# EAGLE design ISPnub_v1.2 (EAGLE 7.2.0)
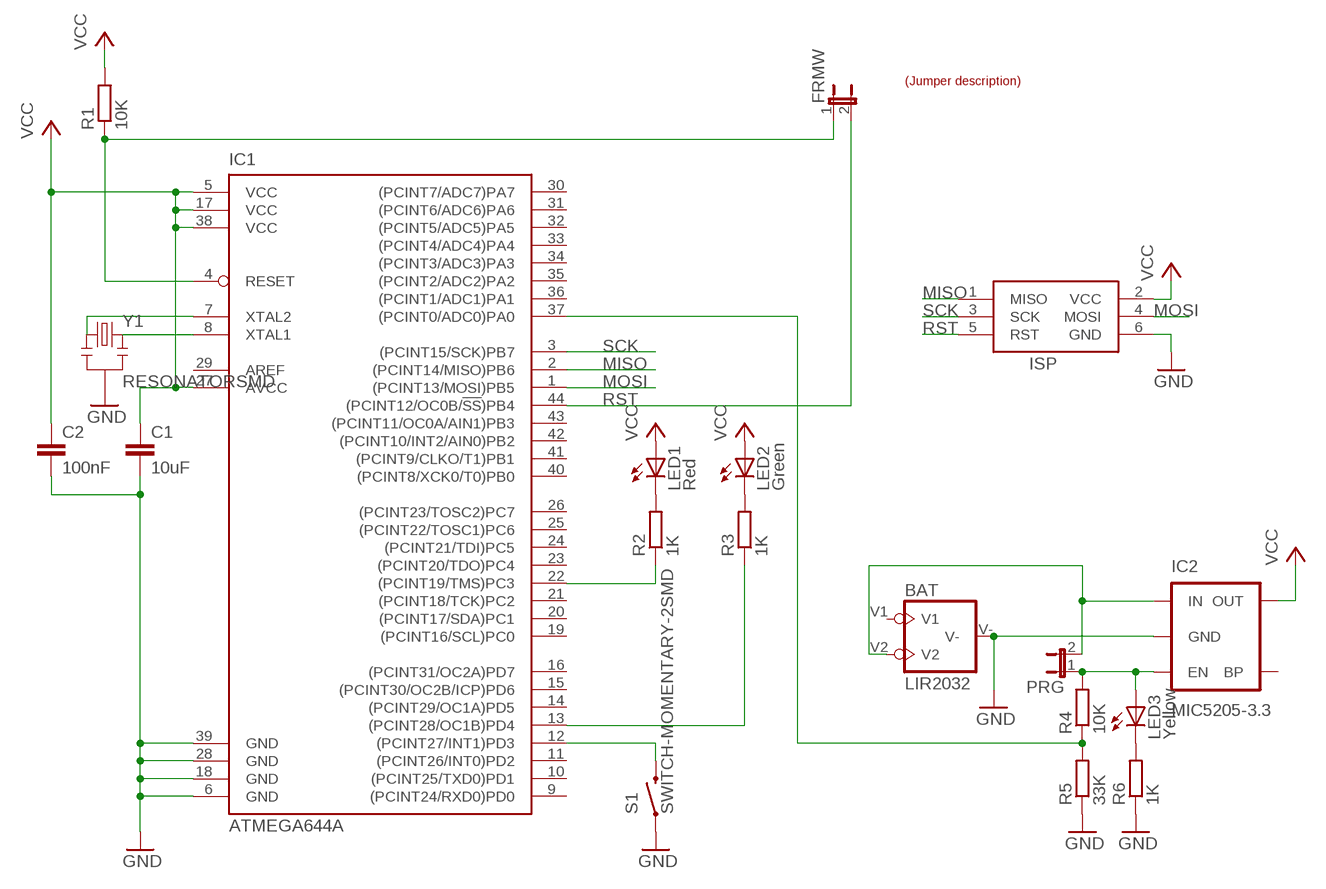
[diagram p0: schematic, sheet 1]

## Parts
BAT  LIR2032  BATTERY_2032  [BATT2032]
C1  10uF  C-EUC0805  [C0805]
C2  100nF  C-EUC0805  [C0805]
FRMW  JP1E  [JP1]
IC1  ATMEGA644A  [TQFP44]
IC2  MIC5205-3.3  V_REG_LDOSMD  [SOT23-5]
ISP  AVRISP-6  [AVRISP]
LED1  Red  LEDCHIP-LED0805  [CHIP-LED0805]
LED2  Green  LEDCHIP-LED0805  [CHIP-LED0805]
LED3  Yellow  LEDCHIP-LED0805  [CHIP-LED0805]
PRG  JP1E  [JP1]
R1  10K  R-EU_R0805  [R0805]
R2  1K  R-EU_R0805  [R0805]
R3  1K  R-EU_R0805  [R0805]
R4  10K  R-EU_R0402  [R0402]
R5  33K  R-EU_R0402  [R0402]
R6  1K  R-EU_R0805  [R0805]
S1  SWITCH-MOMENTARY-2SMD  [TACTILE_SWITCH_SMD]
U$1  LABEL_JUMPER_1X2  [JUMP2_DESC]
Y1  RESONATORSMD  [RESONATOR-SMD]

## Nets
GND: BAT.V- C1.2 C2.2 IC1.6(GND) IC1.18(GND) IC1.28(GND) IC1.39(GND) IC2.2(GND) ISP.6(GND) R5.1 R6.1 S1.1 Y1.2
MISO: IC1.2((PCINT14/MISO)PB6) ISP.1(MISO)
MOSI: IC1.1((PCINT13/MOSI)PB5) ISP.4(MOSI)
N$1: FRMW.1 IC1.4(RESET) R1.1
N$2: IC1.8(XTAL1) Y1.3
N$3: IC1.7(XTAL2) Y1.1
N$4: IC1.12((PCINT27/INT1)PD3) S1.3
N$5: IC1.13((PCINT28/OC1B)PD4) R3.1
N$6: LED2.C R3.2
N$7: IC1.22((PCINT19/TMS)PC3) R2.1
N$8: LED1.C R2.2
N$9: BAT.V2 IC2.1(IN) PRG.2
N$10: IC2.3(EN) LED3.A PRG.1 R4.2
N$11: IC1.37((PCINT0/ADC0)PA0) R4.1 R5.2
N$12: LED3.C R6.2
RST: FRMW.2 IC1.44((PCINT12/OC0B/!SS!)PB4) ISP.5(RST)
SCK: IC1.3((PCINT15/SCK)PB7) ISP.3(SCK)
VCC: C1.1 C2.1 IC1.5(VCC) IC1.17(VCC) IC1.27(AVCC) IC1.38(VCC) IC2.5(OUT) ISP.2(VCC) LED1.A LED2.A R1.2
Unconnected: IC1.9((PCINT24/RXD0)PD0) IC1.10((PCINT25/TXD0)PD1) IC1.11((PCINT26/INT0)PD2) IC1.14((PCINT29/OC1A)PD5) IC1.15((PCINT30/OC2B/ICP)PD6) IC1.16((PCINT31/OC2A)PD7) IC1.19((PCINT16/SCL)PC0) IC1.20((PCINT17/SDA)PC1) IC1.21((PCINT18/TCK)PC2) IC1.23((PCINT20/TDO)PC4) IC1.24((PCINT21/TDI)PC5) IC1.25((PCINT22/TOSC1)PC6) IC1.26((PCINT23/TOSC2)PC7) IC1.29(AREF) IC1.30((PCINT7/ADC7)PA7) IC1.31((PCINT6/ADC6)PA6) IC1.32((PCINT5/ADC5)PA5) IC1.33((PCINT4/ADC4)PA4) IC1.34((PCINT3/ADC3)PA3) IC1.35((PCINT2/ADC2)PA2) IC1.36((PCINT1/ADC1)PA1) IC1.40((PCINT8/XCK0/T0)PB0) IC1.41((PCINT9/CLKO/T1)PB1) IC1.42((PCINT10/INT2/AIN0)PB2) IC1.43((PCINT11/OC0A/AIN1)PB3) IC2.4(BP)

## Power pins joined to a net without a drawn wire
V1: BAT.V1

## Library data of the parts
BAT = dp_devices:BATTERY_2032: BATTERY
C1 C2 = rcl:C-EU: CAPACITOR, European symbol; MOUSER#: 80-C0805C104K5R
FRMW PRG = jumper:JP1E: JUMPER; MOUSER#: 571-826936-2
IC1 = atmel:ATMEGA644: 8-bit Microcontroller with 64K Bytes In-System Programmable Flash Source: http://www.atmel.com/dyn/resources/prod_documents/doc2593.pdf; MOUSER#: 556-ATMEGA1284P-AU; MPN: ATMEGA1284PV-10AU; OC_FARNELL: 1455123; OC_NEWARK: 58M3748
IC2 = Arduino-Pro-Mini-v14Arduino-Pro-Mini:V_REG_LDO: Voltage Regulator LDO Standard 150mA LDO voltage regulator in SOT-23 layout. Micrel part MIC5205. BP (by-pass) pin is used to lower output noise with 470pF cap.
ISP = adafruit:AVRISP: AVR ISP HEADER Standard 6 pin header for AVR programming
LED1 = led:LED: LED OSRAM: - CHIPLED LG R971, LG N971, LY N971, LG Q971, LY Q971, LO R971, LY R971 LH N974, LH R974 LS Q976, LO Q976, LY Q976 LO Q996 - Hyper CHIPLED LW Q18S LB Q993, LB Q99A, LB R99A - SideLED LS A670, LO A670, LY A670, LG A670, LP A670 LB A673, LV A673, LT A673, LW A673 LH A674 LY A675 LS A676, LA A676, LO A676, LY A676, LW A676 LS A679, LY A679, LG A679 - Hyper Micro SIDELED® LS Y876, LA Y876, LO Y876, LY Y876 LT Y87S - SmartLED LW L88C, LW L88S LB L89C, LB L89S, LG L890 LS L89K, LO L89K, LY L89K LS L896, LA L896, LO L896, LY L896 - TOPLED LS T670, LO T670, LY T670, LG T670, LP T670 LSG T670, LSP T670, LSY T670, LOP T670, LYG T670 LG T671, LOG T671, LSG T671 LB T673, LV T673, LT T673, LW T673 LH T674 LS T676, LA T676, LO T676, LY T676, LB T676, LH T676, LSB T676, LW T676 LB T67C, LV T67C, LT T67C, LS T67K, LO T67K, LY T67K, LW E67C LS E67B, LA E67B, LO E67B, LY E67B, LB E67C, LV E67C, LT E67C LW T67C LS T679, LY T679, LG T679 LS T770, LO T770, LY T770, LG T770, LP T770 LB T773, LV T773, LT T773, LW T773 LH T774 LS E675, LA E675, LY E675, LS T675 LS T776, LA T776, LO T776, LY T776, LB T776 LHGB T686 LT T68C, LB T68C - Hyper Mini TOPLED® LB M676 - Mini TOPLED Santana® LG M470 LS M47K, LO M47K, LY M47K Source: http://www.osram.convergy.de LUXEON: - LUMILED® LXK2-PW12-R00, LXK2-PW12-S00, LXK2-PW14-U00, LXK2-PW14-V00 LXK2-PM12-R00, LXK2-PM12-S00, LXK2-PM14-U00 LXK2-PE12-Q00, LXK2-PE12-R00, LXK2-PE12-S00, LXK2-PE14-T00, LXK2-PE14-U00 LXK2-PB12-K00, LXK2-PB12-L00, LXK2-PB12-M00, LXK2-PB14-N00, LXK2-PB14-P00, LXK2-PB14-Q00 LXK2-PR12-L00, LXK2-PR12-M00, LXK2-PR14-Q00, LXK2-PR14-R00 LXK2-PD12-Q00, LXK2-PD12-R00, LXK2-PD12-S00 LXK2-PH12-R00, LXK2-PH12-S00 LXK2-PL12-P00, LXK2-PL12-Q00, LXK2-PL12-R00 Source: www.luxeon.com KINGBRIGHT: KA-3528ASYC Source: www.kingbright.com; MOUSER#: 604-APT1608SURC
LED2 = led:LED: LED OSRAM: - CHIPLED LG R971, LG N971, LY N971, LG Q971, LY Q971, LO R971, LY R971 LH N974, LH R974 LS Q976, LO Q976, LY Q976 LO Q996 - Hyper CHIPLED LW Q18S LB Q993, LB Q99A, LB R99A - SideLED LS A670, LO A670, LY A670, LG A670, LP A670 LB A673, LV A673, LT A673, LW A673 LH A674 LY A675 LS A676, LA A676, LO A676, LY A676, LW A676 LS A679, LY A679, LG A679 - Hyper Micro SIDELED® LS Y876, LA Y876, LO Y876, LY Y876 LT Y87S - SmartLED LW L88C, LW L88S LB L89C, LB L89S, LG L890 LS L89K, LO L89K, LY L89K LS L896, LA L896, LO L896, LY L896 - TOPLED LS T670, LO T670, LY T670, LG T670, LP T670 LSG T670, LSP T670, LSY T670, LOP T670, LYG T670 LG T671, LOG T671, LSG T671 LB T673, LV T673, LT T673, LW T673 LH T674 LS T676, LA T676, LO T676, LY T676, LB T676, LH T676, LSB T676, LW T676 LB T67C, LV T67C, LT T67C, LS T67K, LO T67K, LY T67K, LW E67C LS E67B, LA E67B, LO E67B, LY E67B, LB E67C, LV E67C, LT E67C LW T67C LS T679, LY T679, LG T679 LS T770, LO T770, LY T770, LG T770, LP T770 LB T773, LV T773, LT T773, LW T773 LH T774 LS E675, LA E675, LY E675, LS T675 LS T776, LA T776, LO T776, LY T776, LB T776 LHGB T686 LT T68C, LB T68C - Hyper Mini TOPLED® LB M676 - Mini TOPLED Santana® LG M470 LS M47K, LO M47K, LY M47K Source: http://www.osram.convergy.de LUXEON: - LUMILED® LXK2-PW12-R00, LXK2-PW12-S00, LXK2-PW14-U00, LXK2-PW14-V00 LXK2-PM12-R00, LXK2-PM12-S00, LXK2-PM14-U00 LXK2-PE12-Q00, LXK2-PE12-R00, LXK2-PE12-S00, LXK2-PE14-T00, LXK2-PE14-U00 LXK2-PB12-K00, LXK2-PB12-L00, LXK2-PB12-M00, LXK2-PB14-N00, LXK2-PB14-P00, LXK2-PB14-Q00 LXK2-PR12-L00, LXK2-PR12-M00, LXK2-PR14-Q00, LXK2-PR14-R00 LXK2-PD12-Q00, LXK2-PD12-R00, LXK2-PD12-S00 LXK2-PH12-R00, LXK2-PH12-S00 LXK2-PL12-P00, LXK2-PL12-Q00, LXK2-PL12-R00 Source: www.luxeon.com KINGBRIGHT: KA-3528ASYC Source: www.kingbright.com; MOUSER#: 604-APT2012SGC
LED3 = led:LED: LED OSRAM: - CHIPLED LG R971, LG N971, LY N971, LG Q971, LY Q971, LO R971, LY R971 LH N974, LH R974 LS Q976, LO Q976, LY Q976 LO Q996 - Hyper CHIPLED LW Q18S LB Q993, LB Q99A, LB R99A - SideLED LS A670, LO A670, LY A670, LG A670, LP A670 LB A673, LV A673, LT A673, LW A673 LH A674 LY A675 LS A676, LA A676, LO A676, LY A676, LW A676 LS A679, LY A679, LG A679 - Hyper Micro SIDELED® LS Y876, LA Y876, LO Y876, LY Y876 LT Y87S - SmartLED LW L88C, LW L88S LB L89C, LB L89S, LG L890 LS L89K, LO L89K, LY L89K LS L896, LA L896, LO L896, LY L896 - TOPLED LS T670, LO T670, LY T670, LG T670, LP T670 LSG T670, LSP T670, LSY T670, LOP T670, LYG T670 LG T671, LOG T671, LSG T671 LB T673, LV T673, LT T673, LW T673 LH T674 LS T676, LA T676, LO T676, LY T676, LB T676, LH T676, LSB T676, LW T676 LB T67C, LV T67C, LT T67C, LS T67K, LO T67K, LY T67K, LW E67C LS E67B, LA E67B, LO E67B, LY E67B, LB E67C, LV E67C, LT E67C LW T67C LS T679, LY T679, LG T679 LS T770, LO T770, LY T770, LG T770, LP T770 LB T773, LV T773, LT T773, LW T773 LH T774 LS E675, LA E675, LY E675, LS T675 LS T776, LA T776, LO T776, LY T776, LB T776 LHGB T686 LT T68C, LB T68C - Hyper Mini TOPLED® LB M676 - Mini TOPLED Santana® LG M470 LS M47K, LO M47K, LY M47K Source: http://www.osram.convergy.de LUXEON: - LUMILED® LXK2-PW12-R00, LXK2-PW12-S00, LXK2-PW14-U00, LXK2-PW14-V00 LXK2-PM12-R00, LXK2-PM12-S00, LXK2-PM14-U00 LXK2-PE12-Q00, LXK2-PE12-R00, LXK2-PE12-S00, LXK2-PE14-T00, LXK2-PE14-U00 LXK2-PB12-K00, LXK2-PB12-L00, LXK2-PB12-M00, LXK2-PB14-N00, LXK2-PB14-P00, LXK2-PB14-Q00 LXK2-PR12-L00, LXK2-PR12-M00, LXK2-PR14-Q00, LXK2-PR14-R00 LXK2-PD12-Q00, LXK2-PD12-R00, LXK2-PD12-S00 LXK2-PH12-R00, LXK2-PH12-S00 LXK2-PL12-P00, LXK2-PL12-Q00, LXK2-PL12-R00 Source: www.luxeon.com KINGBRIGHT: KA-3528ASYC Source: www.kingbright.com; MOUSER#: 604-APT1608YC
R1 = rcl:R-EU_: RESISTOR, European symbol; MOUSER#: 603-SR0805JR-0710KL
R2-R6 = rcl:R-EU_: RESISTOR, European symbol; MOUSER#: 71-CRCW0805-1.0K-E3
S1 = Arduino-Pro-Mini-v14Arduino-Pro-Mini:SWITCH-MOMENTARY-2: Various NO switches- pushbuttons, reed, etc; MOUSER#: 693-1301.9314; PROD_ID: SWCH-08247
U$1 = dp_devices:LABEL_JUMPER_1X2: Nice formatted two legged jumperdescription Use attributes to change the values ON = With jumper OFF = Without jumper; OFF: Normal; ON: Update Firmware
Y1 = Arduino-Pro-Mini-v14Arduino-Pro-Mini:RESONATOR: Resonator Small SMD resonator. This is the itty bitty 10/20MHz resonators with built in caps. CSTCE10M0G55 and CSTCE20M0V53. Footprint for SMD has been used in SFE production for years, and does work okay. 1:1 is an attempt to get larger fillets on the sides so it will be easier to inspect these solders in our AOI machine. The pads have been minimized to match the actual metal under the resonator. To see this relation, it includes an image import of the bottom side of the component. Imported to scale on layer 200.

## Board
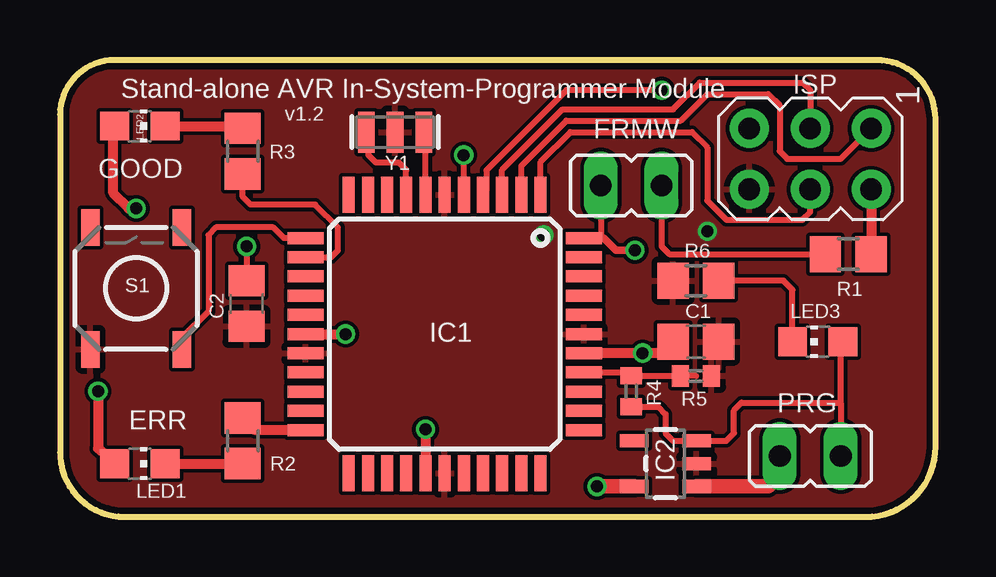
[diagram p1: board, top side]
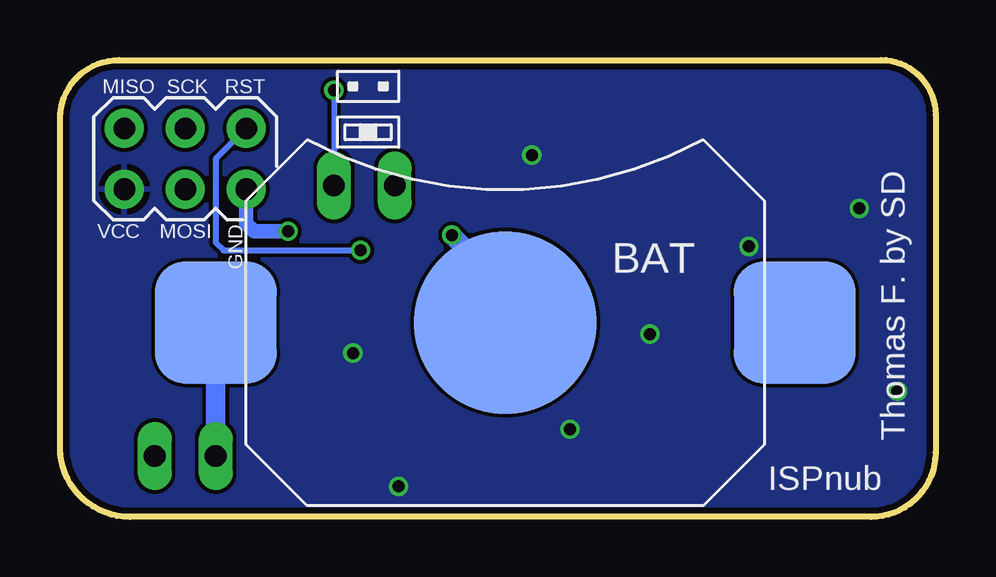
[diagram p2: board, bottom side, seen from below]

Size 36.5 x 19.04 mm. Coordinates in mm from the lower left corner, seen from the top.
Outline: 0,16.76 0,2.69 arc90 2.69,0 33.58,0 arc90 36.5,2.92 36.5,16.58 arc90 34.04,19.04 2.28,19.04 arc90 0,16.76
Copper layers (1*16): Top 0.035mm / dielectric 1.5mm / Bottom 0.035mm
Design rules "Elecrow_2-layer_eagle_rule": minimum track width 6mil, minimum drill 12mil, track to track 6mil, track to pad 6mil, pad to pad 6mil, via to via 6mil, smd to smd 0mil, copper to edge 10mil, drill to drill 10mil, minimum pad ring 10mil, minimum via ring 6mil, stop-mask expansion 2mil, vias tented up to drill 100mil, thermal gap 10mil

### Footprints (pad centres in the part's own frame; a part is rotated, then mirrored left to right if it is on the bottom)
BATT2032 = smd 5.08 x 5.08: V1 -12.065,0; V2 12.065,0 | smd 7.62 x 7.62: V- 0,0
C0805 = smd 1.3 x 1.5: 1 -0.95,0; 2 0.95,0
JP1 = drill 0.914 long: 1 0,-1.27; 2 0,1.27
TQFP44 = smd 1.5 x 0.5: 1 -5.8,4; 2 -5.8,3.2; 3 -5.8,2.4; 4 -5.8,1.6; 5 -5.8,0.8; 6 -5.8,0; 7 -5.8,-0.8; 8 -5.8,-1.6; 9 -5.8,-2.4; 10 -5.8,-3.2; 11 -5.8,-4; 23 5.8,-4; 24 5.8,-3.2; 25 5.8,-2.4; 26 5.8,-1.6; 27 5.8,-0.8; 28 5.8,0; 29 5.8,0.8; 30 5.8,1.6; 31 5.8,2.4; 32 5.8,3.2; 33 5.8,4 | smd 0.5 x 1.5: 12 -4,-5.8; 13 -3.2,-5.8; 14 -2.4,-5.8; 15 -1.6,-5.8; 16 -0.8,-5.8; 17 0,-5.8; 18 0.8,-5.8; 19 1.6,-5.8; 20 2.4,-5.8; 21 3.2,-5.8; 22 4,-5.8; 34 4,5.8; 35 3.2,5.8; 36 2.4,5.8; 37 1.6,5.8; 38 0.8,5.8; 39 0,5.8; 40 -0.8,5.8; 41 -1.6,5.8; 42 -2.4,5.8; 43 -3.2,5.8; 44 -4,5.8
SOT23-5 = smd 0.55 x 1.2: 1 -0.95,-1.3; 2 0,-1.3; 3 0.95,-1.3; 4 0.95,1.3; 5 -0.95,1.3
AVRISP = drill 0.9 pad 1.626: 1 -1.27,2.54; 2 1.27,2.54; 3 -1.27,0; 4 1.27,0; 5 -1.27,-2.54; 6 1.27,-2.54
CHIP-LED0805 = smd 1.2 x 1.2: A 0,-1.05; C 0,1.05
R0805 = smd 1.3 x 1.5: 1 -0.95,0; 2 0.95,0
R0402 = smd 0.7 x 0.9: 1 -0.65,0; 2 0.65,0
TACTILE_SWITCH_SMD = smd 1.524 x 0.762: 1 -2.54,1.905; 2 2.54,1.905; 3 -2.54,-1.905; 4 2.54,-1.905
RESONATOR-SMD = smd 0.7 x 1.7: 1 -1.2,0; 2 0,0; 3 1.2,0

### Placement (x,y rotation side)
BAT  17.94,8.1 180 bottom
C1  26.51,7.3 0 top
C2  7.78,8.89 270 top
FRMW  23.81,13.81 90 top
IC1  16.03,7.62 270 top
IC2  25.24,2.22 90 top
ISP  31.27,14.92 270 top
LED1  3.33,2.22 270 top
LED2  3.33,16.29 270 top
LED3  31.59,7.3 90 top
PRG  31.27,2.54 90 top
R1  32.86,10.95 0 top
R2  7.62,3.17 270 top
R3  7.62,15.24 90 top
R4  23.81,5.24 270 top
R5  26.51,5.87 180 top
R6  26.51,9.84 0 top
S1  3.17,9.53 90 top
U$1  21.11,16.67 0 bottom
Y1  13.97,16.03 180 top

### Tracks (layer width: path | path; a pad name or v marks a point on that pad's centre or on a via)
GND  (via drill 0.5)
  Bottom 0.254: BAT.V- 17.94,9.53
  Bottom 0.61: ISP.6 28.73,12.22 28.42,11.91 v26.99,11.91
  Bottom 0.813: 17.94,9.53 v20.16,11.75
  pour Top: 0,0 36.83,0 36.83,19.68 0,19.68
MISO
  Top 0.254: IC1.2 19.23,14.63 21.11,16.51 25.88,16.51 26.99,17.62 29.53,17.62 30,17.14 30,15.24 30.32,14.92 32.54,14.92 ISP.1
MOSI
  Top 0.254: IC1.1 20.03,14.79 21.27,16.03 26.35,16.03 26.99,15.4 26.99,13.18 27.78,12.38 30.96,12.38 31.27,12.7 ISP.4
N$1  (via drill 0.5)
  Top 0.254: v25.08,17.78 21.11,17.78 17.78,14.45 17.78,13.59 IC1.4 | FRMW.1 25.08,11.27 25.4,10.95 R1.1
  Bottom 0.254: v25.08,17.78 FRMW.1
N$2
  Top 0.254: IC1.8 14.43,14.43 14.45,14.45 14.13,14.76 13.18,14.76 12.86,15.08 12.86,15.95 Y1.3
N$3
  Top 0.254: IC1.7 15.23,15.65 Y1.1
N$4
  Top 0.254: IC1.12 9.34,11.62 8.89,12.06 6.51,12.06 6.19,11.75 6.19,8.57 5.08,7.46 S1.3
N$5
  Top 0.254: IC1.13 11.3,10.82 11.59,11.11 11.59,12.06 10.64,13.02 7.94,13.02 7.62,13.34 R3.1
N$6
  Top 0.254: 7.52,16.29 R3.2
  Top 0.406: LED2.C 7.52,16.29
N$7
  Top 0.254: 8.12,3.62 R2.1
  Top 0.406: IC1.22 8.12,3.62
N$8
  Top 0.254: 7.52,2.22 R2.2
  Top 0.406: LED1.C 7.52,2.22
N$9
  Top 0.61: IC2.1 29.53,1.27 30,1.75 PRG.2
  Bottom 0.813: BAT.V2 PRG.2
N$10
  Top 0.254: 32.54,4.76 28.42,4.76 28.1,4.45 28.1,3.49 27.78,3.17 IC2.3 25.56,3.17 25.24,3.49 25.24,4.29 24.94,4.59 R4.2 | 32.54,4.76 PRG.1 | 32.54,4.76 32.54,7.21 LED3.A
N$11
  Top 0.254: IC1.37 23.36,6.02 R4.1 23.96,5.89 24.92,5.87 R5.2 26.51,5.87
N$12
  Top 0.254: LED3.C 30.54,9.46 30.16,9.84 R6.2
RST  (via drill 0.5)
  Top 0.254: FRMW.2 22.54,11.62
  Top 0.305: IC1.44 22.54,11.62 22.67,11.62 23.18,11.11 v23.97,11.11
  Bottom 0.254: ISP.5 30,14.92 30,11.43 29.69,11.11 v23.97,11.11
SCK
  Top 0.254: IC1.3 18.43,14.46 20.95,16.99 25.56,16.99 26.67,18.1 30.96,18.1 31.27,17.78 ISP.3
VCC  (via drill 0.5)
  Top 0.254: IC1.38 | IC1.27 | v7.78,11.27 C2.1 | R1.2 | v16.83,15.08 IC1.5
  Top 0.406: C1.1 25.56,7.15 25.24,6.83 v24.29,6.83 IC1.38 | v15.24,3.65 IC1.27 | IC1.17 v11.91,7.62 | v3.17,12.86 2.86,12.86 2.22,13.49 2.22,16.19 LED2.A | v1.59,5.24 1.59,2.86 LED1.A | ISP.2 R1.2
  Top 0.61: v22.38,1.27 IC2.5
  pour Bottom: 0,0 36.83,0 36.83,19.68 0,19.68

### Text on the board
tNames: Stand-alone AVR In-System-Programmer Module | v1.2 | GOOD | ERR
bNames: RST | SCK | MISO | MOSI | VCC | GND | Thomas F. by SD | ISPnub